# Altium schematic sheet Interface.SchDoc: EEG Measurement Circuit
size A2; Date: 24/01/2025; DrawnBy: Giang Phan Truong; SheetNumber: 7; SheetTotal: 7
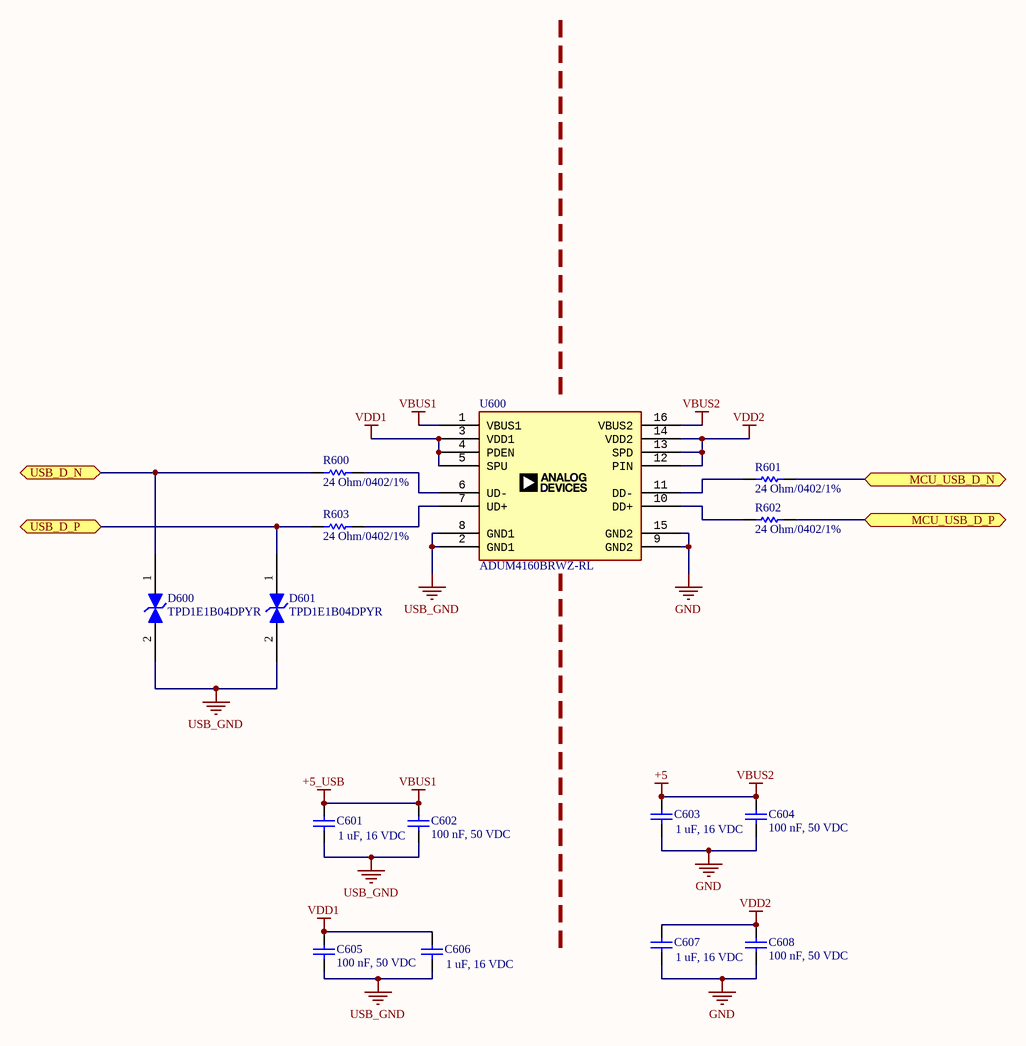
[diagram p0: Interface.SchDoc]

## Parts
C601  1 uF, 16 VDC  [CAP_0603]
C602  100 nF, 50 VDC  [CAP_0603]
C603  1 uF, 16 VDC  [CAP_0603]
C604  100 nF, 50 VDC  [CAP_0603]
C605  100 nF, 50 VDC  [CAP_0603]
C606  1 uF, 16 VDC  [CAP_0603]
C607  1 uF, 16 VDC  [CAP_0603]
C608  100 nF, 50 VDC  [CAP_0603]
D600  TPD1E1B04DPYR  [DIO_TPD1E05U06DPYR]
D601  TPD1E1B04DPYR  [DIO_TPD1E05U06DPYR]
R600  value 24 Ohm/0402/1%  [R0402]  (hidden comment: Resistor 24 Ohm 0402 1%)
R601  value 24 Ohm/0402/1%  [R0402]  (hidden comment: Resistor 24 Ohm 0402 1%)
R602  value 24 Ohm/0402/1%  [R0402]  (hidden comment: Resistor 24 Ohm 0402 1%)
R603  value 24 Ohm/0402/1%  [R0402]  (hidden comment: Resistor 24 Ohm 0402 1%)
U600  ADUM4160BRWZ-RL  [SOIC16]

## Ports
MCU_USB_D_N (bidir, see Block Diagram[6B], Digital Processing[2B]), MCU_USB_D_P (bidir, see Block Diagram[6B], Digital Processing[2B]), USB_D_N (bidir, see Block Diagram[7B], Power Supplies[2A]), USB_D_P (bidir, see Block Diagram[7B], Power Supplies[2A])

## Nets
+5: C603.2 C604.1 U600.16(VBUS2)  [also labelled VBUS2]
+5_USB: C601.2 C602.1 U600.1(VBUS1)  [also labelled VBUS1]
GND: C603.1 C604.2 C607.1 C608.2 U600.9(GND2) U600.15(GND2)
USB_GND: C601.1 C602.2 C605.2 C606.1 D600.2 D601.2 U600.2(GND1) U600.8(GND1)
VDD1: C605.1 C606.2 U600.3(VDD1) U600.4(PDEN) U600.5(SPU)
VDD2: C607.2 C608.1 U600.12(PIN) U600.13(SPD) U600.14(VDD2)
MCU_USB_D_N: R601.2 ; port MCU_USB_D_N
MCU_USB_D_P: R602.2 ; port MCU_USB_D_P
USB_D_N: D600.1 R600.1 ; port USB_D_N
USB_D_P: D601.1 R603.1 ; port USB_D_P
NetR600_2: R600.2 U600.6(UD-)
NetR601_1: R601.1 U600.11(DD-)
NetR602_1: R602.1 U600.10(DD+)
NetR603_2: R603.2 U600.7(UD+)

## Notes on the sheet
- Project Name:
- Date:
- Size
- Size:
- A2
- Last Modified:
- Revision:
- Drawn By:
- File:
- Checked By:
- Sheet
- of

## Library data of the parts
C601 C603 C606 C607 = 0106031051016: CAP, size 0603, 1 uF, 16 VDC; Manufacture Name: Samsung Electro-Mechanics; Manufacture SN: CL10B105KO8NNWC; Capacitance: 1 uF; Tolerance: +/-10%; Voltage Rating DC: 16 VDC; Operating Temperature: -55 to +125degC; Packaging: Tape and Reel; Mounting Technology: SMT; Size: 0603; Supplier 1 Name: Mouser; Supplier 1 SN: 187-CL10B105KO8NNWC; Supplier 1 URL: https://www.mouser.vn/ProductDetail/Samsung-Electro-Mechanics/CL10B105KO8NNWC?qs=81r%252BiQLm7BT%252BXtc72qn1ug%3D%3D&utm_source=mouser-refine-download&utm_medium=file&utm_campaign=CL10B105KO8NNWC&utm_content=Samsung-Electro-Mechanics; Supplier 2 Name: Digi-Key; Supplier 2 SN: 1276-CL10B105KO8NNWCTR-ND; Supplier 2 URL: https://www.digikey.com/en/products/detail/samsung-electro-mechanics/cl10b105ko8nnwc/16572783; Supplier 3 Name: thegioiic; Supplier 3 SN: N/A; Supplier 3 URL: https://www.thegioiic.com/tu-gom-0603-1uf-16v; Value: 1 uF, 16 VDC; Buy: https://tme.vn/Product.aspx?id=728#page=pro_info
C602 C604 C605 C608 = 0106031041050: CAP, size 0603, 100 nF, 50 VDC; Manufacture Name: TDK; Manufacture SN: CGA3E3X8R1H104K080AE; Capacitance: 100 nF; Tolerance: +/-10%; Voltage Rating DC: 50 VDC; ComponentLink2Description: Datasheet; ComponentLink2URL: https://product.tdk.com/system/files/dam/doc/product/capacitor/ceramic/mlcc/catalog/mlcc_automotive_soft_en.pdf?ref_disty=mouser; Operating Temperature: -55 to +125degC; Packaging: Tape and Reel; Mounting Technology: SMT; Size: 0603; Supplier 1 Name: Mouser; Supplier 1 SN: 810-CGA3E3X8R1H104KA; Supplier 1 URL: https://www.mouser.com/ProductDetail/TDK/CGA3E3X8R1H104K080AE?qs=nQSIdc08i%252Bd8g3IRRgU2bw%3D%3D&utm_source=mouser-refine-download&utm_medium=file&utm_campaign=CGA3E3X8R1H104K080AE&utm_content=TDK; Supplier 2 Name: Digi-Key; Supplier 2 SN: 445-173697-2-ND; Supplier 2 URL: https://www.digikey.com/en/products/detail/tdk-corporation/cga3e3x8r1h104k080ae/5809262; Supplier 3 Name: thegioiic; Supplier 3 SN: N/A; Supplier 3 URL: N/A; Value: 100 nF, 50 VDC; Buy: https://tme.vn/Product.aspx?id=739#page=pro_info
D600 D601 = TPD1E1B04DPYR: 8.5V (Typ) Clamp 6.3A (8/20µs) Ipp Tvs Diode Surface Mount 2-X1SON (1x.60); MF: Texas Instruments; Mouser-Purchase-URL: https://snapeda.com/shop?store=Mouser&id=616615; Price: None; Availability: Warning; SnapEDA_Link: https://www.snapeda.com/parts/TPD1E1B04DPYR/Texas%20Instruments/view-part/616615/?ref=snap; Texas_Instruments-Purchase-URL: https://snapeda.com/shop?store=Texas+Instruments&id=616615; Package: X1SON-2 Texas Instruments; MP: TPD1E1B04DPYR; Value: TPD1E1B04DPYR
R600-R603 = Resistor 24 Ohm 0402 1%: 1/16W Thick Film Resistors 50V ±5% ±200ppm/℃ 24Ω 0402 Chip Resistor - Surface Mount ROHS; Buy: https://www.lcsc.com/product-detail/Chip-Resistor-Surface-Mount_FH-Guangdong-Fenghua-Advanced-Tech-RC-02W240JT_C258123.html?s_z=n_24%2520Ohm
U600 = ADUM4160BRWZ-RL: USB Digital Isolator 5000Vrms 1 Channel 12Mbps 25kV/µs CMTI 16-SOIC (0.295", 7.50mm Width); Buy: https://www.lcsc.com/product-detail/Isolated-USB-ICs_Analog-Devices-ADUM4160BRWZ-RL_C57791.html; Value: ADUM4160BRWZ-RL